# Altium schematic sheet Switches.SchDoc
size A4
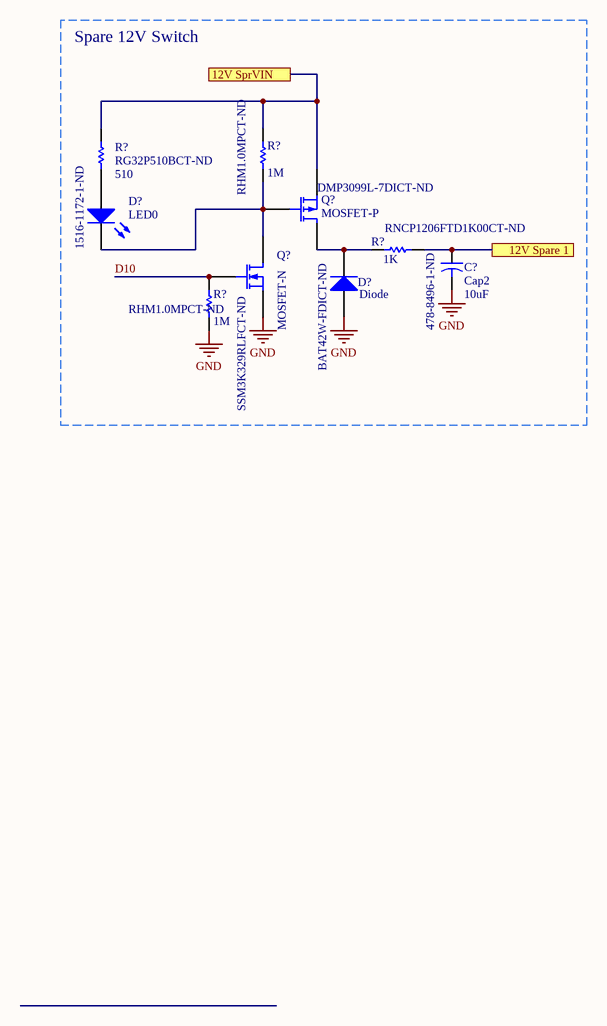
[diagram p0: Switches.SchDoc]

## Parts
(Parts that share a designator on the sheet are numbered #1, #2 ... from top to bottom, then left to right.)
C?  Cap2  value 10uF  Supplier Part Number 1: 478-8496-1-ND  [C1206]
D?#1  LED0  Supplier Part Number 1: 1516-1172-1-ND  [C1206]
D?#2  Diode  Supplier Part Number 1: BAT42W-FDICT-ND  [sod-123]
Q?#1  MOSFET-P  Supplier Part Number 1: DMP3099L-7DICT-ND
Q?#2  MOSFET-N  Supplier Part Number 1: SSM3K329RLFCT-ND  [SOT23f]
R?#1  value 510  Supplier Part Number 1: RG32P510BCT-ND  [C1206]  (hidden comment: 1206)
R?#2  value 1M  Supplier Part Number 1: RHM1.0MPCT-ND  [C1206]  (hidden comment: 1206)
R?#3  1K  Supplier Part Number: RNCP1206FTD1K00CT-ND  [RESC3216X60N]
R?#4  value 1M  Supplier Part Number 1: RHM1.0MPCT-ND  [C1206]  (hidden comment: 1206)

## Blocks framed on the sheet
Spare 12V Switch: C? D?#1 D?#2 Q?#1 Q?#2 R?#1-R?#4

## Ports
12V Spare 1, 12V SprVIN

## Nets
GND: C?.2 D?#2.1(A) Q?#2.3(S) R?#4.1
12V Spare 1: C?.1 R?#3.2 ; port 12V Spare 1
12V SprVIN: Q?#1.3(S) R?#1.1 R?#2.2 ; port 12V SprVIN
D10: Q?#2.2(G) R?#4.2
NetD?#1_1: D?#1.1(A) R?#1.2
NetD?#1_2: D?#1.2(K) Q?#1.2(G) Q?#2.1(D) R?#2.1
NetD?#2_2: D?#2.2(K) Q?#1.1(D) R?#3.1

## Library data of the parts
C? = Cap2: Capacitor. Ceramic 10uF 50V rating recommended, place close to pin; Published: 23-Sep-2002; PackageReference: CAPR5-4X5; Publisher: Altium Limited; PackageDescription: Capacitor; 2 Leads; Supplier 1: Digi-Key
D?#1 = LED0: Typical INFRARED GaAs LED; Published: 8-Jun-2000; LatestRevisionDate: 08-Jul-2005; LatestRevisionNote: Mech Layer 1 removed.; PackageReference: LED-0; Publisher: Altium Limited; PackageDescription: LED; 2 Leads; Supplier 1: Digi-Key
D?#2 = Diode: Default Diode; Published: 8-Jun-2000; LatestRevisionDate: 17-Jul-2002; LatestRevisionNote: Re-released for DXP Platform.; PackageVersion: Sep-1996; PackageReference: SMC; Publisher: Altium Limited; PackageDescription: DO-214-AB/SMC; 2 C-Bend Leads; Body 7.9 x 5.9 mm, inc. leads (LxW); Code_JEDEC: DO-214-AB; Supplier 1: Digi-Key
Q?#1 = MOSFET-P: P-Channel MOSFET; Published: 8-Jun-2000; LatestRevisionDate: 17-Jul-2002; LatestRevisionNote: Re-released for DXP Platform.; PackageVersion: 1995/1996; PackageReference: E3; Publisher: Altium Limited; PackageDescription: TO, Flat Index; 3 In-Line, Axial Leads; Body Dia. 4.6mm; Lead Dia. 0.5 mm (max); Supplier 1: Digi-Key
Q?#2 = MOSFET-N: N-Channel MOSFET; Published: 8-Jun-2000; LatestRevisionDate: 17-Jul-2002; LatestRevisionNote: Re-released for DXP Platform.; PackageVersion: 1995/1996; PackageReference: E3; Publisher: Altium Limited; PackageDescription: TO, Flat Index; 3 In-Line, Axial Leads; Body Dia. 4.6mm; Lead Dia. 0.5 mm (max); Supplier 1: Digi-Key
R?#1 R?#2 R?#4 = Res1: Resistor; Published: 8-Jun-2000; LatestRevisionDate: 17-Jul-2002; LatestRevisionNote: Re-released for DXP Platform.; PackageReference: AXIAL-0.3; Publisher: Altium Limited; PackageDescription: Axial Device, Thru-Hole; 2 Leads; 0.3 in Pin Spacing; Supplier 1: Digi-Key
R?#3 = Res1: Resistor; Manufacturer: Stackpole Electronics; Manufacturer Part Number: RNCP1206FTD1K00; Resistance: 10kR; Tolerance: 1%; Temperature Coefficient: 100ppm/°C; Max Power Dissipation: 500mW; Value: 1K; Supplier 1: Digi-Key; Stock 1: 679; Pricing 1: 1=0.1, 10=0.052, 100=0.0211, 1000=0.00949, 2500=0.00824 (USD); Mount: Surface Mount; Case/Package: 1206; Case Code (Metric): 3216; Case Code (Imperial): 1206; Contact Plating: Nickel,Tin,Matte; Min Operating Temperature: -55°C; Max Operating Temperature: 155°C; Packaging: Tape and Reel; Composition: Thin Film; Number of Terminations: 2; Length: 0.122inch; Height: 0.024inch; Width: 0.059inch; Radiation Hardening: No; Lead Free: Lead Free; ComponentLink1URL: http://www.seielect.com/Catalog/SEI-rncp.pdf; ComponentLink1Description: http://www.seielect.com/Catalog/SEI-rncp.pdf; ComponentLink2URL: https://www.seielect.com/catalog/SEI-Packaging.pdf; ComponentLink2Description: https://www.seielect.com/catalog/SEI-Packaging.pdf